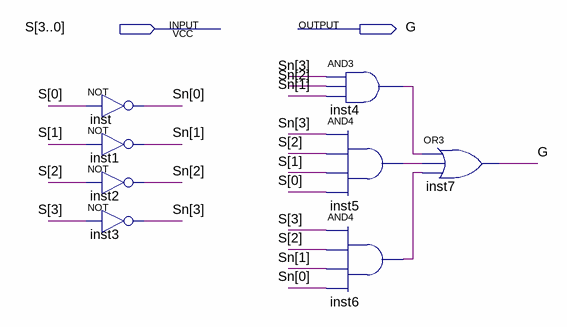
[diagram p0: schematic sheet]
// Quartus schematic G.bdf as structural Verilog: 8 symbols, 2 pins
module G (
  input  [3:0] S,
  output G
);

  wire inst4_out, inst5_out, inst6_out;
  wire [3:0] Sn;

  not inst (Sn[0], S[0]);
  not inst1 (Sn[1], S[1]);
  not inst2 (Sn[2], S[2]);
  not inst3 (Sn[3], S[3]);
  and inst4 (inst4_out, Sn[3], Sn[2], Sn[1]);
  and inst5 (inst5_out, Sn[3], S[2], S[1], S[0]);
  and inst6 (inst6_out, S[3], S[2], Sn[1], Sn[0]);
  or inst7 (G, inst4_out, inst5_out, inst6_out);
endmodule
